# EAGLE schematic V0p2_Main_PCB2 (EAGLE 7.1.0)
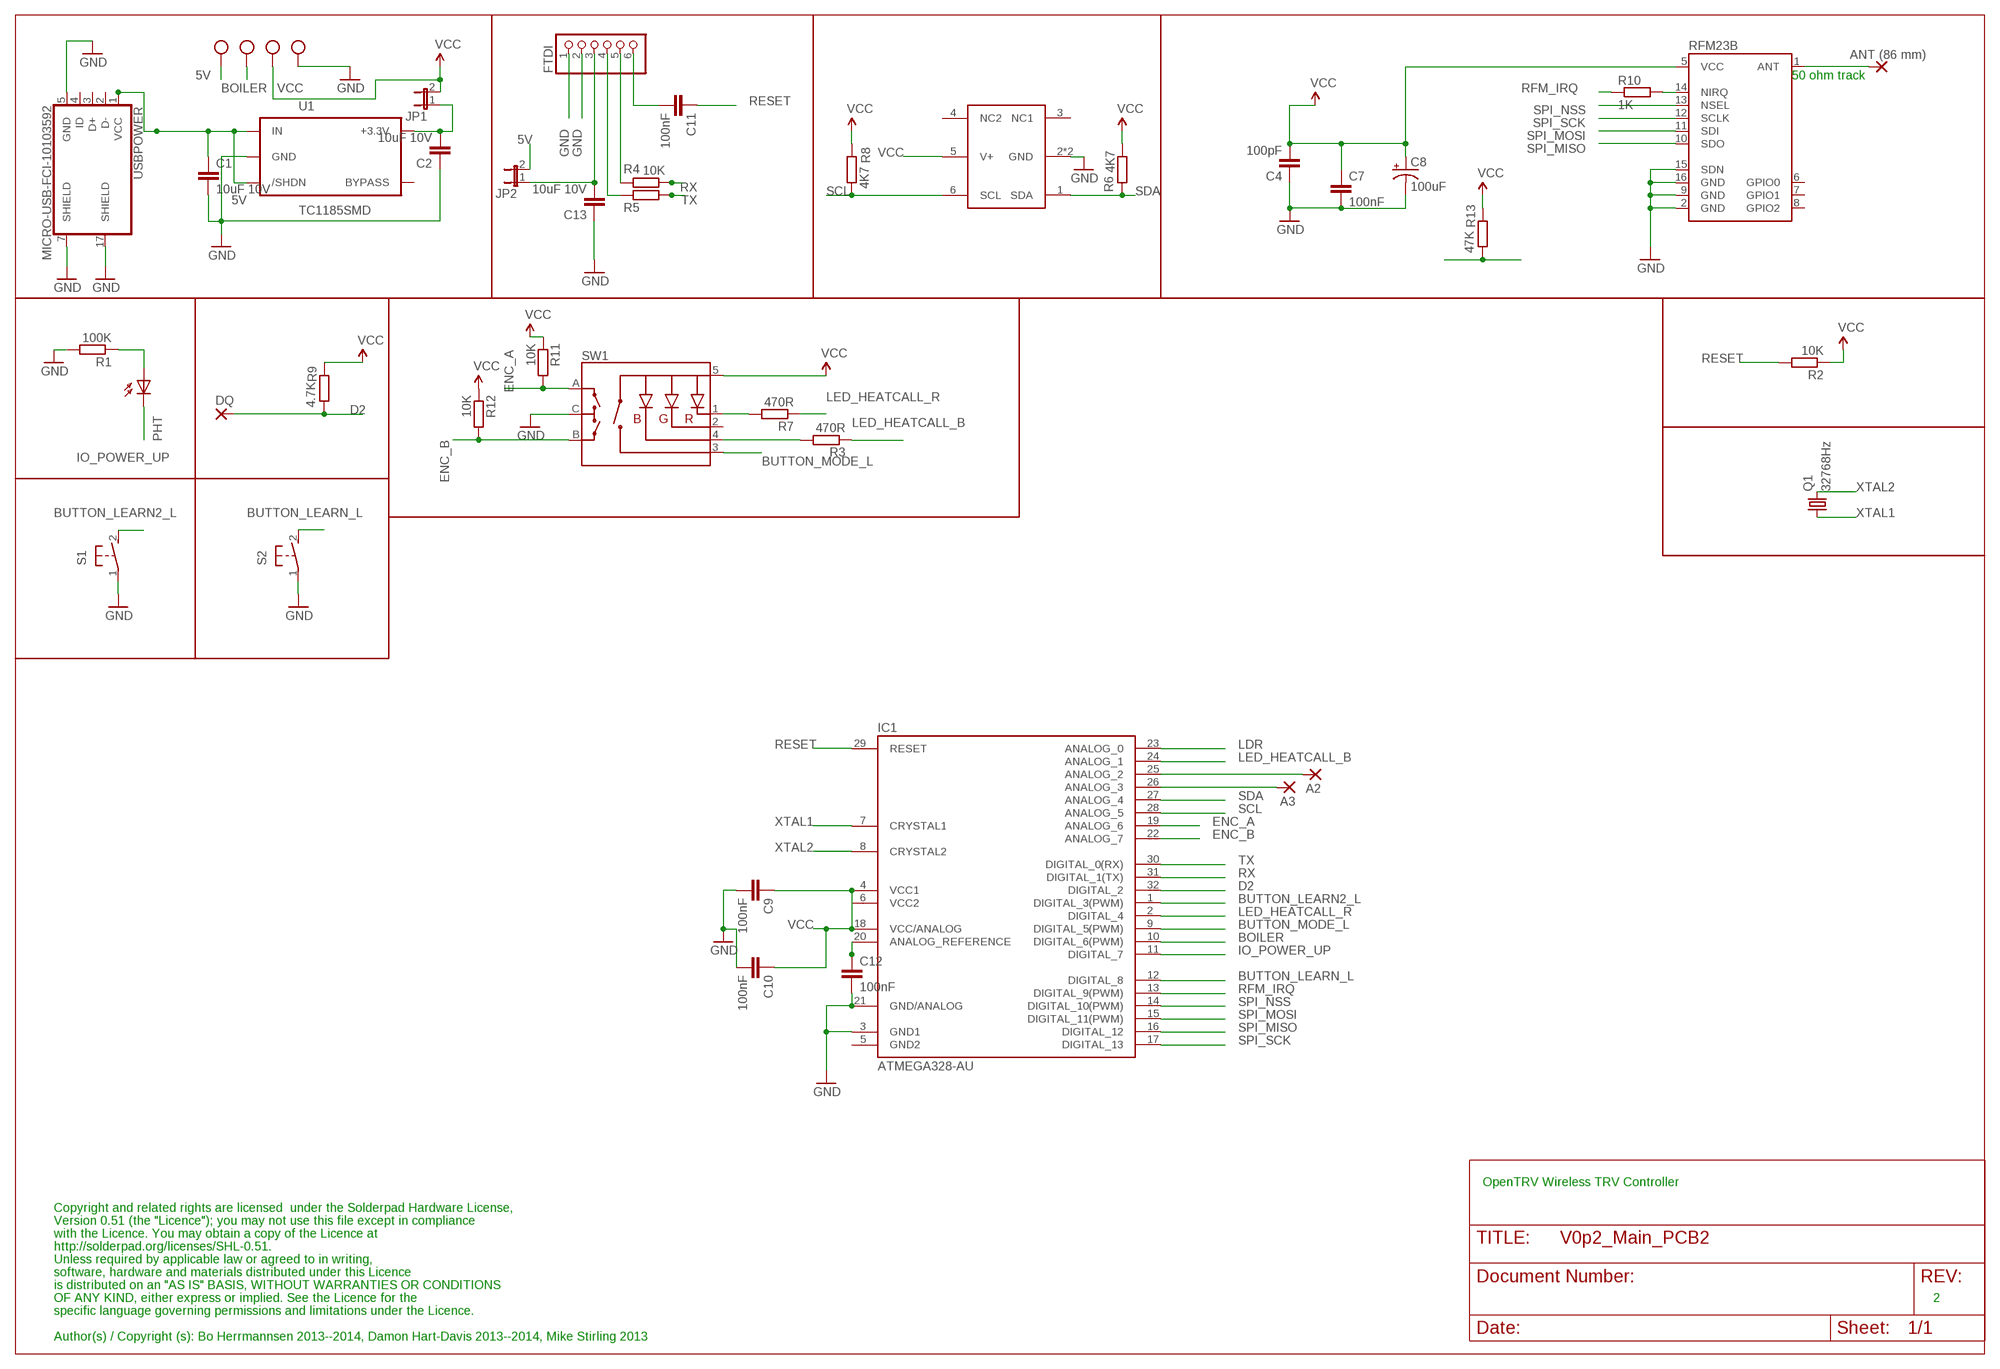
[diagram p0: schematic, sheet 1]

## Parts
A2  2,15/1,0  [2,15/1,0]
A3  2,15/1,0  [2,15/1,0]
ANT1  ANT (86 mm)  2,15/1,0  [2,15/1,0]
C1  10uF 10V  C-EUC0603  [C0603]
C2  10uF 10V  C-EUC0603  [C0603]
C4  100pF  C-EUC0603  [C0603]
C7  100nF  C-EUC0603  [C0603]
C8  100uF  CAP_POL1206  [EIA3216]
C9  100nF  C-EUC0603  [C0603]
C10  100nF  C-EUC0603  [C0603]
C11  100nF  C-EUC0603  [C0603]
C12  100nF  C-EUC0603  [C0603]
C13  10uF 10V  C-EUC0603  [C0603]
DQ  2,15/1,0  [2,15/1,0]
FTDI  PINHD-1X6/90  [1X06/90]
IC1  ATMEGA328-AU  ATMEGA168-MU  [MLF32]
JP1  JP1E  [JP1]
JP2  JP1E  [JP1]
PHT  BPX65  [BPX65]
Q1  32768Hz  MC-306  [MC-306]
R1  100K  R-EU_R0603  [R0603]
R2  10K  R-EU_R0603  [R0603]
R3  470R  R-EU_R0603  [R0603]
R4  10K  R-EU_R0603  [R0603]
R5  10K  R-EU_R0603  [R0603]
R6  4K7  R-EU_R0603  [R0603]
R7  470R  R-EU_R0603  [R0603]
R8  4K7  R-EU_R0603  [R0603]
R9  4.7K  R-EU_R0603  [R0603]
R10  1K  R-EU_R0603  [R0603]
R11  10K  R-EU_R0603  [R0603]
R12  10K  R-EU_R0603  [R0603]
R13  47K  R-EU_R0603  [R0603]
RFM23B  RFM23B  [RFM23-XXX-S1]
S1  31-XX  [B3F-31XX]
S2  31-XX  [B3F-31XX]
SW1  ENCODER_RGB_CA  [ENCODER_LED_3]
U1  TC1185SMD  [TC1185]
U$4  SHT21  [SHT21]
USBPOWER  MICRO-USB-FCI-10103592  [MICRO-USB-FCI-10103592]
X1  W237-102  [SCREWTERMINAL]
X2  W237-102  [SCREWTERMINAL]

## Nets
5V [supply]: C1.1 JP2.2 U1.1(IN) U1.3(/SHDN) USBPOWER.1(VCC) X1.2
BOILER: IC1.10(DIGITAL_6(PWM)) X1.1
BUTTON_LEARN2_L: IC1.1(DIGITAL_3(PWM)) S1.2(S)
BUTTON_LEARN_L: IC1.12(DIGITAL_8) S2.2(S)
BUTTON_MODE_L: IC1.9(DIGITAL_5(PWM)) SW1.3(SW)
D2: DQ.1(P) IC1.32(DIGITAL_2) R9.1
ENC_A: R11.2 SW1.A
ENC_B: R12.2 SW1.B
GND [supply]: C1.2 C2.1 C4.1 C7.2 C8.C(-) C9.2 C10.2 C12.2 C13.1 FTDI.1 FTDI.2 IC1.3(GND1) IC1.21(GND/ANALOG) R1.2 RFM23B.2(GND) RFM23B.9(GND) RFM23B.15(SDN) RFM23B.16(GND) S1.1(P) S2.1(P) SW1.C U1.2(GND) U$4.2(GND) U$4.P$1(GND) USBPOWER.5(GND) USBPOWER.7(SHIELD) USBPOWER.17(SHIELD) X2.2
IO_POWER_UP [supply]: IC1.11(DIGITAL_7) PHT.K(C)
LDR: IC1.23(ANALOG_0) PHT.A R1.1
LED_HEATCALL_B: IC1.24(ANALOG_1) R3.1
LED_HEATCALL_R: IC1.2(DIGITAL_4) R7.1
N$1: C11.2 FTDI.6
N$3: FTDI.4 R5.2
N$5: FTDI.5 R4.2
N$6 [supply]: C12.1 IC1.20(ANALOG_REFERENCE)
N$7: R10.2 RFM23B.14(NIRQ)
N$8 [supply]: C2.2 JP1.1 U1.5(+3.3V)
N$11 [supply]: C13.2 FTDI.3 JP2.1
N$13: R3.2 R7.2 SW1.1(-R) SW1.4(-B)
N$24: A2.1(P) IC1.25(ANALOG_2)
N$25: A3.1(P) IC1.26(ANALOG_3)
N$31 [ant]: ANT1.1(P) RFM23B.1(ANT)
RESET: C11.1 IC1.29(RESET) R2.2
RFM_IRQ: IC1.13(DIGITAL_9(PWM)) R10.1
RX: IC1.31(DIGITAL_1(TX)) R4.1
SCL: IC1.28(ANALOG_5) R8.1 U$4.6(SCL)
SDA: IC1.27(ANALOG_4) R6.2 U$4.1(SDA)
SPI_MISO: IC1.16(DIGITAL_12) RFM23B.10(SDO)
SPI_MOSI: IC1.15(DIGITAL_11(PWM)) RFM23B.11(SDI)
SPI_NSS: IC1.14(DIGITAL_10(PWM)) R13.1 RFM23B.13(NSEL)
SPI_SCK: IC1.17(DIGITAL_13) RFM23B.12(SCLK)
TX: IC1.30(DIGITAL_0(RX)) R5.1
VCC [supply]: C4.2 C7.1 C8.A(+) C9.1 C10.1 IC1.4(VCC1) IC1.18(VCC/ANALOG) JP1.2 R2.1 R6.1 R8.2 R9.2 R11.1 R12.1 R13.2 RFM23B.5(VCC) SW1.5(+) U$4.5(V+) X2.1
XTAL1: IC1.7(CRYSTAL1) Q1.1
XTAL2: IC1.8(CRYSTAL2) Q1.4
Unconnected: IC1.19(ANALOG_6) IC1.22(ANALOG_7) RFM23B.6(GPIO0) RFM23B.7(GPIO1) RFM23B.8(GPIO2) SW1.2(-G) U1.4(BYPASS) U$4.3(NC1) U$4.4(NC2) USBPOWER.2(D-) USBPOWER.3(D+) USBPOWER.4(ID)

## Notes on the sheet
- 50 ohm track
- OpenTRV Wireless TRV Controller
- Copyright and related rights are licensed  under the Solderpad Hardware License,
- Version 0.51 (the "Licence"); you may not use this file except in compliance
- with the Licence. You may obtain a copy of the Licence at
- http://solderpad.org/licenses/SHL-0.51.
- Unless required by applicable law or agreed to in writing,
- software, hardware and materials distributed under this Licence
- is distributed on an "AS IS" BASIS, WITHOUT WARRANTIES OR CONDITIONS
- OF ANY KIND, either express or implied. See the Licence for the | 2
- specific language governing permissions and limitations under the Licence.
- Author(s) / Copyright (s): Bo Herrmannsen 2013--2014, Damon Hart-Davis 2013--2014, Mike Stirling 2013

## Power pins joined to a net without a drawn wire
GND2: IC1.5(GND2)
VCC2: IC1.6(VCC2)

## Library data of the parts
A2 A3 ANT1 DQ = wirepad:2,15/1,0: THROUGH-HOLE PAD
C1 C2 C4 C7 C9-C13 = resistor:C-EU: CAPACITOR, European symbol
C8 = SparkFun-Passives:CAP_POL: Capacitor Polarized These are standard SMD and PTH capacitors. Normally 10uF, 47uF, and 100uF in electrolytic and tantalum varieties. Always verify the external diameter of the through hole cap, it varies with capacity, voltage, and manufacturer. The EIA devices should be standard.
FTDI = pinhead:PINHD-1X6: PIN HEADER
IC1 = Arduino-AVR:ATMEGA168
JP1 JP2 = jumper:JP1E: JUMPER
PHT = opto-trans-siemens:BPX65: PHOTO DIODE; MPN: BPX65.; OC_FARNELL: 327451; OC_NEWARK: 06WX2764
Q1 = crystal:MC-306: kHz RANGE CRYSTAL UNIT SMD Source: MC-306_405_406_E07X.PDF Homepage <http://www.epsontoyocom.co.jp>; MPN: MC-306 60.0KHZ 100PPM ,12.5PF; OC_FARNELL: 1278040; OC_NEWARK: 31M5576
R1-R13 = resistor:R-EU_: RESISTOR, European symbol
RFM23B = SparkFun-RF:RFM23B
S1 S2 = adafruit:31-XX: OMRON SWITCH Now with beefier pads!
SW1 = SparkFun-Electromechanical:ENCODER_RGB_CA: Illuminated Rotary Encoder w/ RGB LED and select switch EC12PLRGBSDVBF-D: http://top-up.so-buy.com/front/bin/ptdetail.phtml?Part=EC12PLRGBSDVBF-D
U1 = 3.3VREG:TC1185
U$4 = SHT21:SHT21: Tempsensor RS No: 709-8868 MRF No: TMP112AIDRLT
USBPOWER = micro-usb-fci-10103592:MICRO-USB-FCI-10103592: Micro USB B Connector RS No: 714-2334 MRF No: 10103592-0001LF
X1 X2 = screwterminal:W237-102: Screw terminal 3.5mm Pitch RS No: 710-0444 MRF No:1776275-2; MPN: 237-102; OC_FARNELL: unknown; OC_NEWARK: 70K9898

## Net classes
0 default: width 0.203 mm
1 supply: width 0.406 mm, clearance 0.203 mm
2 ant: width 2.184 mm